# Altium project VENTUNOQ.PrjPcb (part 17 of 18)
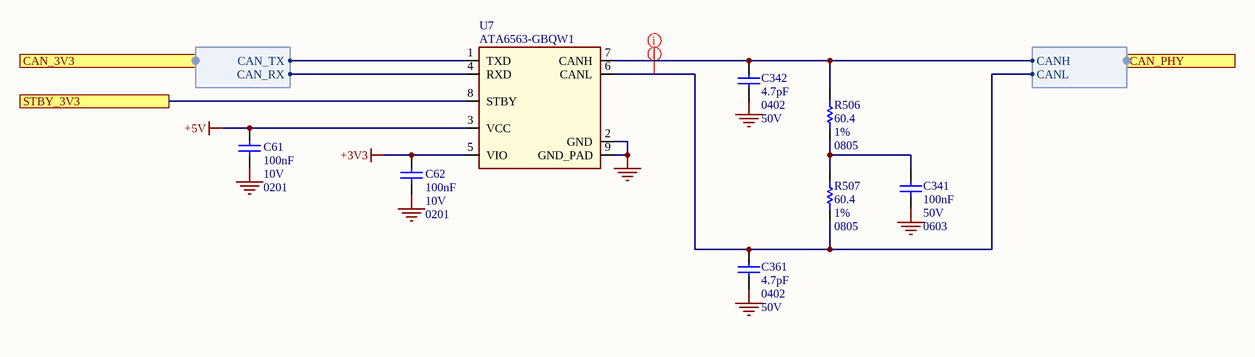
[diagram p52: CAN_PHY.SchDoc]
## Nets that join several sheets
7V-24V: USB_PD_CONTROLLER (D9.A), HEADERS_UNO (F2.1), POWER (11 pins), HEADERS_JOMEGA (8 pins), HEADERS_JMEDIA_JMISC (F3.1)
+1.28V: POWER_REGULATORS_CARRIER (5 pins), AUDIO_CODEC (C136.2 C146.2 U23.36)
+1V1: ETH_PHY (12 pins), POWER_REGULATORS_CARRIER (8 pins), PCIE_PACKET_SWITCH (11 pins), PCIE_USB (39 pins)
+1V8: U_ETH/U_ETH_PHY/U_LOAD_SWITCH_5V (U27_3.6 U27_3.11), POWER (R21.2 R22.2 R265.1 TP84.X), AUDIO_CODEC (7 pins), HDMI_CONVERTER (5 pins), STM32 (R218.1)
+3V3: TOP (11 pins), MODULE_PWR (27 pins), MODULE_CONTROL (12 pins), USB_MUX (R475.2), USB_PD_CONTROLLER (R275.1), U_USB/U_LOAD_SWITCH_5V (C179_1.2 U27_1.3), U_USB/U_LOAD_SWITCH_5V (C179_2.2 U27_2.3), U_ETH/U_ETH_PHY/U_LOAD_SWITCH_5V (C179_3.2 U27_3.3), ETH_RJ45 (J2.14 J2.16), POWER (9 pins), POWER_DCDC_SOM (23 pins), POWER_REGULATORS_CARRIER (9 pins), U_POWER/U_LOAD_SWITCH_5V (C179_4.2 U27_4.3), U_POWER/U_LOAD_SWITCH_5V (C179_5.2 U27_5.3 U27_5.6 U27_5.11), HDMI_CONVERTER (L16.1), U_MIPI/U_MIPI_MUX (C69_1.2 U10_1.1), U_MIPI/U_MIPI_MUX (C69_2.2 U10_2.1), U_MIPI/U_MIPI_FLAT_22PIN (D15_1.2 J3_1.22), U_MIPI/U_MIPI_FLAT_22PIN (D15_2.2 J3_2.22), U_MIPI/U_MIPI_MUX (C69_3.2 U10_3.1), U_MIPI/U_MIPI_FLAT_22PIN (D15_3.2 J3_3.22), U_MIPI/U_TRANSLATOR_4CH (C175_2.2 U21_2.11), HEADERS_JOMEGA (JOMEGA.91 JOMEGA.93 JOMEGA.95), STM32 (35 pins), U_MICROCONTROLLER/U_LED/U_LED_RGB (DL1_1.1), U_MICROCONTROLLER/U_LED/U_LED_RGB (DL1_2.1), U_MICROCONTROLLER/U_LED/U_LED_RGB (DL1_3.1), U_MICROCONTROLLER/U_LED/U_LED_RGB (DL1_4.1), ANALOG_SWITCH (C274.2 U28.4 U28.5), U_MICROCONTROLLER/U_TRANSLATOR_4CH (C175_3.2 U21_3.11), HEADERS_JMEDIA_JMISC (5 pins), HEADERS_JCTL (R317.2), T8CH_ (C174_5.2 U33_5.19), HEATSINK_FAN (C306.2 R261.2 R455.2 U32.5), PCIE (R327.1 R328.1 R329.1), PCIE_PACKET_SWITCH (37 pins), U_PCIE/U_PCIE_NVME/U_LOAD_SWITCH_5V (C179_6.2 U27_6.3 U27_6.6 U27_6.11), WIFI_BLE (12 pins), U_PCIE/U_WIFI_BLE/U_TRANSLATOR_4CH (C175_4.2 U21_4.11), PCIE_USB (13 pins), U_PCIE/U_TRANSLATOR_4CH (C175_5.2 U21_5.11), CAN_PHY (C62.2 U7.5)
+3V3_LIMITED: HEADERS_UNO (JANALOG.2 JANALOG.4), POWER (C222.2), U_POWER/U_LOAD_SWITCH_5V (U27_5.7 U27_5.8 U27_5.9 U27_5.10), HEADERS_JHAT (6 pins), U_HEADERS_JHAT/T8CH_ (C174_2.2 U33_2.19), U_HEADERS_JHAT/T8CH_ (C174_3.2 U33_3.19), U_HEADERS_JHAT/T8CH_ (C174_4.2 U33_4.19), U_HEADERS_JHAT/U_TRANSLATOR_4CH (C175_1.2 U21_1.11), QWIIC (C271.2 D82.2 J13.2)
+5V: USB_PD_CONTROLLER (R276.2), U_USB/U_LOAD_SWITCH_5V (U27_1.6 U27_1.11), U_USB/U_LOAD_SWITCH_5V (U27_2.6 U27_2.11), POWER (R336.1), POWER_REGULATORS_CARRIER (12 pins), U_POWER/U_LOAD_SWITCH_5V (U27_4.6 U27_4.11), AUDIO_CODEC (C165.2 C166.2 U23.14 U23.15), HDMI_CONNECTOR (D3.A R492.2 R495.2), HEADERS_JOMEGA (JOMEGA.97 JOMEGA.99), HEADERS_JMEDIA_JMISC (JMISC.54 JMISC.56), HEATSINK_FAN (5 pins), CAN_PHY (C61.2 U7.3)
+5V_LIMITED: HEADERS_UNO (JANALOG.5 JSPI.2), POWER (C221.2), U_POWER/U_LOAD_SWITCH_5V (U27_4.7 U27_4.8 U27_4.9 U27_4.10), HEADERS_JHAT (J6.2 J6.4)
CYPD_VDDIO: USB_MUX (R476.2), USB_PD_CONTROLLER (13 pins), U_USB/U_USB_PD_CONTROLLER/T8CH_ (C174_1.2 U33_1.19)
GND: TOP (12 pins), MODULE_GND (1526 pins), MODULE_PWR (12 pins), MODULE_SAIL (TP30.X), MODULE_SAIL_FLASH (7 pins), MODULE_STRAPS_MD (10 pins), MODULE_STRAPS_SAIL (13 pins), MODULE_CONTROL (12 pins), USB (12 pins), USB_USBC (19 pins), USB_MUX (13 pins), USB_PD_CONTROLLER (43 pins), U_USB/U_USB_PD_CONTROLLER/T8CH_ (5 pins), USB_USBA (16 pins), U_USB/U_LOAD_SWITCH_5V (C179_1.1 C246_1.1 U27_1.2), U_USB/U_LOAD_SWITCH_5V (C179_2.1 C246_2.1 U27_2.2), ETH (C67.1 C68.1 U8.3 U9.3), ETH_PHY (45 pins), U_ETH/U_ETH_PHY/U_LOAD_SWITCH_5V (C179_3.1 C246_3.1 U27_3.2), ETH_RJ45 (C66.2 R109.1), HEADERS_UNO (5 pins), POWER (30 pins), POWER_DCDC_SOM (51 pins), POWER_REGULATORS_CARRIER (49 pins), U_POWER/U_LOAD_SWITCH_5V (C179_4.1 C246_4.1 U27_4.2), U_POWER/U_LOAD_SWITCH_5V (C179_5.1 C246_5.1 U27_5.2), AUDIO_CODEC (24 pins), HEADERS_JHAT (8 pins), U_HEADERS_JHAT/T8CH_ (5 pins), U_HEADERS_JHAT/T8CH_ (5 pins), U_HEADERS_JHAT/T8CH_ (5 pins), U_HEADERS_JHAT/U_TRANSLATOR_4CH (C172_1.1 C175_1.1 C220_1.2 U21_1.6), VIDEO (5 pins), HDMI (R269.1), HDMI_CONNECTOR (18 pins), HDMI_CONVERTER (22 pins), U_MIPI/U_MIPI_MUX (8 pins), U_MIPI/U_MIPI_MUX (8 pins), U_MIPI/U_MIPI_FLAT_22PIN (17 pins), U_MIPI/U_MIPI_FLAT_22PIN (17 pins), U_MIPI/U_MIPI_MUX (8 pins), U_MIPI/U_MIPI_FLAT_22PIN (17 pins), U_MIPI/U_TRANSLATOR_4CH (C172_2.1 C175_2.1 C220_2.2 U21_2.6), PUSHBUTTONS (6 pins), HEADERS_JOMEGA (50 pins), MICROCONTROLLER (R184.1), STM32 (59 pins), QWIIC (6 pins), ANALOG_SWITCH (C274.1 U28.2), U_MICROCONTROLLER/U_TRANSLATOR_4CH (C172_3.1 C175_3.1 C220_3.2 U21_3.6), HEADERS_JMEDIA_JMISC (63 pins), HEADERS_JCTL (12 pins), T8CH_ (5 pins), HEATSINK_FAN (13 pins), PCIE (R315.1 R323.1 R468.1), PCIE_PACKET_SWITCH (42 pins), PCIE_NVME (40 pins), U_PCIE/U_PCIE_NVME/U_LOAD_SWITCH_5V (C179_6.1 C246_6.1 U27_6.2), WIFI_BLE (63 pins), U_PCIE/U_WIFI_BLE/U_TRANSLATOR_4CH (C172_4.1 C175_4.1 C220_4.2 U21_4.6), PCIE_USB (43 pins), U_PCIE/U_TRANSLATOR_4CH (C172_5.1 C175_5.1 C220_5.2 U21_5.6), CAN_PHY (7 pins)
SOM_VCOIN: MODULE_PWR (R399.1), HEADERS_JMEDIA_JMISC (R508.2)
SOM_VREG_MDPX3_1P8: TOP (10 pins), MODULE_PWR (MODULE1.BD42 MODULE1.BE42 MODULE1.BF42 TP88.X), MODULE_STRAPS_MD (10 pins), USB_PD_CONTROLLER (R330.1 R331.1 R332.1), U_USB/U_USB_PD_CONTROLLER/T8CH_ (C173_1.2 R168_1.2 U33_1.2), POWER (R21.1 R497.2), POWER_REGULATORS_CARRIER (R146.1 R147.1 U16.5 U17.5), AUDIO_CODEC (R270.2), HEADERS_JHAT (R422.1 R423.1 R424.1 R425.1), U_HEADERS_JHAT/T8CH_ (C173_2.2 R168_2.2 U33_2.2), U_HEADERS_JHAT/T8CH_ (C173_3.2 R168_3.2 U33_3.2), U_HEADERS_JHAT/T8CH_ (C173_4.2 R168_4.2 U33_4.2), U_HEADERS_JHAT/U_TRANSLATOR_4CH (C172_1.2 R326_1.2 U21_1.1), VIDEO (8 pins), U_MIPI/U_TRANSLATOR_4CH (C172_2.2 R326_2.2 U21_2.1), HEADERS_JOMEGA (JOMEGA.79 JOMEGA.81), MICROCONTROLLER (R412.1), STM32 (R351.1), U_MICROCONTROLLER/U_TRANSLATOR_4CH (C172_3.2 R326_3.2 U21_3.1), HEADERS_JMEDIA_JMISC (JMISC.57), HEADERS_JCTL (D63.2 JCTL.9 R166.1), T8CH_ (C173_5.2 R168_5.2 U33_5.2), PCIE (R319.1 R320.1 R321.1 R322.2), PCIE_NVME (R224.1 R414.2 R415.2 R416.2), WIFI_BLE (R23.2 R314.1 R465.2), U_PCIE/U_WIFI_BLE/U_TRANSLATOR_4CH (C172_4.2 R326_4.2 U21_4.1), U_PCIE/U_TRANSLATOR_4CH (C172_5.2 R326_5.2 U21_5.1)
SOM_VREG_S5S_SPX3_1P8: MODULE_PWR (MODULE1.AW45 MODULE1.AW46), MODULE_SAIL (TP1.X), MODULE_SAIL_FLASH (12 pins), MODULE_STRAPS_SAIL (13 pins), HEADERS_JOMEGA (JOMEGA.77), HEADERS_JCTL (R458.1)
VBAT: STM32 (C63.2 C282.2 U3.D3), HEADERS_JMEDIA_JMISC (R509.2)
1V05_PG (PULLUP 1V8): ETH_PHY (R85.1), POWER (R265.2), POWER_REGULATORS_CARRIER (U17.1)
3V3_PG (PULLUP 3V3): TOP (R349.1), POWER_DCDC_SOM (R124.2 U11.1 U11.2)
A_CLK_N: U_MIPI/U_MIPI_MUX (U10_1.18), HEADERS_JMEDIA_JMISC (D91.1 D91.10 JMEDIA.3)
A_CLK_N: U_MIPI/U_MIPI_MUX (U10_2.18), HEADERS_JMEDIA_JMISC (D93.4 D93.7 JMEDIA.33)
A_CLK_N: U_MIPI/U_MIPI_MUX (U10_3.18), HEADERS_JMEDIA_JMISC (D96.2 D96.9 JMEDIA.42)
A_CLK_P: U_MIPI/U_MIPI_MUX (U10_1.19), HEADERS_JMEDIA_JMISC (D91.2 D91.9 JMEDIA.5)
A_CLK_P: U_MIPI/U_MIPI_MUX (U10_2.19), HEADERS_JMEDIA_JMISC (D93.5 D93.6 JMEDIA.35)
A_CLK_P: U_MIPI/U_MIPI_MUX (U10_3.19), HEADERS_JMEDIA_JMISC (D96.1 D96.10 JMEDIA.40)
A_LN0_N: U_MIPI/U_MIPI_MUX (U10_1.37), HEADERS_JMEDIA_JMISC (D90.1 D90.10 JMEDIA.12)
A_LN0_N: U_MIPI/U_MIPI_MUX (U10_2.37), HEADERS_JMEDIA_JMISC (D92.4 D92.7 JMEDIA.21)
A_LN0_N: U_MIPI/U_MIPI_MUX (U10_3.37), HEADERS_JMEDIA_JMISC (D97.2 D97.9 JMEDIA.54)
A_LN0_P: U_MIPI/U_MIPI_MUX (U10_1.38), HEADERS_JMEDIA_JMISC (D90.2 D90.9 JMEDIA.10)
A_LN0_P: U_MIPI/U_MIPI_MUX (U10_2.38), HEADERS_JMEDIA_JMISC (D92.5 D92.6 JMEDIA.23)
A_LN0_P: U_MIPI/U_MIPI_MUX (U10_3.38), HEADERS_JMEDIA_JMISC (D97.1 D97.10 JMEDIA.52)
A_LN1_N: U_MIPI/U_MIPI_MUX (U10_1.35), HEADERS_JMEDIA_JMISC (D90.4 D90.7 JMEDIA.6)
A_LN1_N: U_MIPI/U_MIPI_MUX (U10_2.35), HEADERS_JMEDIA_JMISC (D93.1 D93.10 JMEDIA.27)
A_LN1_N: U_MIPI/U_MIPI_MUX (U10_3.35), HEADERS_JMEDIA_JMISC (D96.5 D96.6 JMEDIA.48)
A_LN1_P: U_MIPI/U_MIPI_MUX (U10_1.36), HEADERS_JMEDIA_JMISC (D90.5 D90.6 JMEDIA.4)
A_LN1_P: U_MIPI/U_MIPI_MUX (U10_2.36), HEADERS_JMEDIA_JMISC (D93.2 D93.9 JMEDIA.29)
A_LN1_P: U_MIPI/U_MIPI_MUX (U10_3.36), HEADERS_JMEDIA_JMISC (D96.4 D96.7 JMEDIA.46)
A_LN2_N: U_MIPI/U_MIPI_MUX (U10_1.33), HEADERS_JMEDIA_JMISC (D91.4 D91.7 JMEDIA.9)
A_LN2_N: U_MIPI/U_MIPI_MUX (U10_2.33), HEADERS_JMEDIA_JMISC (D94.1 D94.10 JMEDIA.39)
A_LN2_N: U_MIPI/U_MIPI_MUX (U10_3.33), HEADERS_JMEDIA_JMISC (D95.5 D95.6 JMEDIA.36)
A_LN2_P: U_MIPI/U_MIPI_MUX (U10_1.34), HEADERS_JMEDIA_JMISC (D91.5 D91.6 JMEDIA.11)
A_LN2_P: U_MIPI/U_MIPI_MUX (U10_2.34), HEADERS_JMEDIA_JMISC (D94.2 D94.9 JMEDIA.41)
A_LN2_P: U_MIPI/U_MIPI_MUX (U10_3.34), HEADERS_JMEDIA_JMISC (D95.4 D95.7 JMEDIA.34)
A_LN3_N: U_MIPI/U_MIPI_MUX (U10_1.31), HEADERS_JMEDIA_JMISC (D92.1 D92.10 JMEDIA.15)
A_LN3_N: U_MIPI/U_MIPI_MUX (U10_2.31), HEADERS_JMEDIA_JMISC (D94.4 D94.7 JMEDIA.45)
A_LN3_N: U_MIPI/U_MIPI_MUX (U10_3.31), HEADERS_JMEDIA_JMISC (D95.2 D95.9 JMEDIA.30)
A_LN3_P: U_MIPI/U_MIPI_MUX (U10_1.32), HEADERS_JMEDIA_JMISC (D92.2 D92.9 JMEDIA.17)
A_LN3_P: U_MIPI/U_MIPI_MUX (U10_2.32), HEADERS_JMEDIA_JMISC (D94.5 D94.6 JMEDIA.47)
A_LN3_P: U_MIPI/U_MIPI_MUX (U10_3.32), HEADERS_JMEDIA_JMISC (D95.1 D95.10 JMEDIA.28)
B_CLK_N: HDMI_CONVERTER (U22.F2), U_MIPI/U_MIPI_MUX (U10_1.20)
B_CLK_N: U_MIPI/U_MIPI_MUX (U10_2.20), U_MIPI/U_MIPI_FLAT_22PIN (D7_2.1 D7_2.10 J3_2.8)
B_CLK_N: U_MIPI/U_MIPI_FLAT_22PIN (D7_1.1 D7_1.10 J3_1.8), U_MIPI/U_MIPI_MUX (U10_3.20)
B_CLK_P: HDMI_CONVERTER (U22.G2), U_MIPI/U_MIPI_MUX (U10_1.21)
B_CLK_P: U_MIPI/U_MIPI_MUX (U10_2.21), U_MIPI/U_MIPI_FLAT_22PIN (D7_2.2 D7_2.9 J3_2.9)
B_CLK_P: U_MIPI/U_MIPI_FLAT_22PIN (D7_1.2 D7_1.9 J3_1.9), U_MIPI/U_MIPI_MUX (U10_3.21)
B_LN0_N: HDMI_CONVERTER (U22.F3), U_MIPI/U_MIPI_MUX (U10_1.28)
B_LN0_N: U_MIPI/U_MIPI_MUX (U10_2.28), U_MIPI/U_MIPI_FLAT_22PIN (D6_2.1 D6_2.10 J3_2.2)
B_LN0_N: U_MIPI/U_MIPI_FLAT_22PIN (D6_1.1 D6_1.10 J3_1.2), U_MIPI/U_MIPI_MUX (U10_3.28)
B_LN0_P: HDMI_CONVERTER (U22.G3), U_MIPI/U_MIPI_MUX (U10_1.29)
B_LN0_P: U_MIPI/U_MIPI_MUX (U10_2.29), U_MIPI/U_MIPI_FLAT_22PIN (D6_2.2 D6_2.9 J3_2.3)
B_LN0_P: U_MIPI/U_MIPI_FLAT_22PIN (D6_1.2 D6_1.9 J3_1.3), U_MIPI/U_MIPI_MUX (U10_3.29)
B_LN1_N: HDMI_CONVERTER (U22.F4), U_MIPI/U_MIPI_MUX (U10_1.26)
B_LN1_N: U_MIPI/U_MIPI_MUX (U10_2.26), U_MIPI/U_MIPI_FLAT_22PIN (D6_2.4 D6_2.7 J3_2.5)
B_LN1_N: U_MIPI/U_MIPI_FLAT_22PIN (D6_1.4 D6_1.7 J3_1.5), U_MIPI/U_MIPI_MUX (U10_3.26)
B_LN1_P: HDMI_CONVERTER (U22.G4), U_MIPI/U_MIPI_MUX (U10_1.27)
B_LN1_P: U_MIPI/U_MIPI_MUX (U10_2.27), U_MIPI/U_MIPI_FLAT_22PIN (D6_2.5 D6_2.6 J3_2.6)
B_LN1_P: U_MIPI/U_MIPI_FLAT_22PIN (D6_1.5 D6_1.6 J3_1.6), U_MIPI/U_MIPI_MUX (U10_3.27)
B_LN2_N: HDMI_CONVERTER (U22.F5), U_MIPI/U_MIPI_MUX (U10_1.24)
B_LN2_N: U_MIPI/U_MIPI_MUX (U10_2.24), U_MIPI/U_MIPI_FLAT_22PIN (D7_2.4 D7_2.7 J3_2.11)
B_LN2_N: U_MIPI/U_MIPI_FLAT_22PIN (D7_1.4 D7_1.7 J3_1.11), U_MIPI/U_MIPI_MUX (U10_3.24)
B_LN2_P: HDMI_CONVERTER (U22.G5), U_MIPI/U_MIPI_MUX (U10_1.25)
B_LN2_P: U_MIPI/U_MIPI_MUX (U10_2.25), U_MIPI/U_MIPI_FLAT_22PIN (D7_2.5 D7_2.6 J3_2.12)
B_LN2_P: U_MIPI/U_MIPI_FLAT_22PIN (D7_1.5 D7_1.6 J3_1.12), U_MIPI/U_MIPI_MUX (U10_3.25)
B_LN3_N: HDMI_CONVERTER (U22.F6), U_MIPI/U_MIPI_MUX (U10_1.22)
B_LN3_N: U_MIPI/U_MIPI_MUX (U10_2.22), U_MIPI/U_MIPI_FLAT_22PIN (D8_2.1 D8_2.10 J3_2.14)
B_LN3_N: U_MIPI/U_MIPI_FLAT_22PIN (D8_1.1 D8_1.10 J3_1.14), U_MIPI/U_MIPI_MUX (U10_3.22)
B_LN3_P: HDMI_CONVERTER (U22.G6), U_MIPI/U_MIPI_MUX (U10_1.23)
B_LN3_P: U_MIPI/U_MIPI_MUX (U10_2.23), U_MIPI/U_MIPI_FLAT_22PIN (D8_2.2 D8_2.9 J3_2.15)
B_LN3_P: U_MIPI/U_MIPI_FLAT_22PIN (D8_1.2 D8_1.9 J3_1.15), U_MIPI/U_MIPI_MUX (U10_3.23)
BOOT0: HEADERS_UNO (JANALOG.1), MICROCONTROLLER (R151.1), STM32 (R352.2 R385.1 TP90.X)
CLKREQ_N_1V8: MODULE_MD (MODULE1.AW17), PCIE (R320.2), U_PCIE/U_TRANSLATOR_4CH (U21_5.3)
CLKREQ_N_3V3: PCIE (R328.2), PCIE_PACKET_SWITCH (U34.AM34), U_PCIE/U_TRANSLATOR_4CH (U21_5.9)
CSI0_CK_N: MODULE_MD (MODULE1.AK45), U_MIPI/U_MIPI_MUX (U10_2.15)
CSI0_CK_P: MODULE_MD (MODULE1.AK46), U_MIPI/U_MIPI_MUX (U10_2.14)
CSI0_L0_N: MODULE_MD (MODULE1.AL44), U_MIPI/U_MIPI_MUX (U10_2.6)
CSI0_L0_P: MODULE_MD (MODULE1.AL45), U_MIPI/U_MIPI_MUX (U10_2.5)
CSI0_L1_N: MODULE_MD (MODULE1.AM45), U_MIPI/U_MIPI_MUX (U10_2.8)
CSI0_L1_P: MODULE_MD (MODULE1.AM46), U_MIPI/U_MIPI_MUX (U10_2.7)
CSI0_L2_N: MODULE_MD (MODULE1.AN44), U_MIPI/U_MIPI_MUX (U10_2.11)
CSI0_L2_P: MODULE_MD (MODULE1.AN45), U_MIPI/U_MIPI_MUX (U10_2.10)
CSI0_L3_N: MODULE_MD (MODULE1.AP45), U_MIPI/U_MIPI_MUX (U10_2.13)
CSI0_L3_P: MODULE_MD (MODULE1.AP46), U_MIPI/U_MIPI_MUX (U10_2.12)
CSI1_CK_N: MODULE_MD (MODULE1.AE44), U_MIPI/U_MIPI_MUX (U10_3.15)
CSI1_CK_P: MODULE_MD (MODULE1.AE45), U_MIPI/U_MIPI_MUX (U10_3.14)
CSI1_L0_N: MODULE_MD (MODULE1.AF45), U_MIPI/U_MIPI_MUX (U10_3.6)
CSI1_L0_P: MODULE_MD (MODULE1.AF46), U_MIPI/U_MIPI_MUX (U10_3.5)
CSI1_L1_N: MODULE_MD (MODULE1.AG44), U_MIPI/U_MIPI_MUX (U10_3.8)
CSI1_L1_P: MODULE_MD (MODULE1.AG45), U_MIPI/U_MIPI_MUX (U10_3.7)
CSI1_L2_N: MODULE_MD (MODULE1.AH45), U_MIPI/U_MIPI_MUX (U10_3.11)
CSI1_L2_P: MODULE_MD (MODULE1.AH46), U_MIPI/U_MIPI_MUX (U10_3.10)
CSI1_L3_N: MODULE_MD (MODULE1.AJ44), U_MIPI/U_MIPI_MUX (U10_3.13)
CSI1_L3_P: MODULE_MD (MODULE1.AJ45), U_MIPI/U_MIPI_MUX (U10_3.12)
CSI2_CK_N: MODULE_MD (MODULE1.Y45), U_MIPI/U_MIPI_FLAT_22PIN (D7_3.1 D7_3.10 J3_3.8)
CSI2_CK_P: MODULE_MD (MODULE1.Y46), U_MIPI/U_MIPI_FLAT_22PIN (D7_3.2 D7_3.9 J3_3.9)
CSI2_L0_N: MODULE_MD (MODULE1.AA44), U_MIPI/U_MIPI_FLAT_22PIN (D6_3.1 D6_3.10 J3_3.2)
CSI2_L0_P: MODULE_MD (MODULE1.AA45), U_MIPI/U_MIPI_FLAT_22PIN (D6_3.2 D6_3.9 J3_3.3)
CSI2_L1_N: MODULE_MD (MODULE1.AB45), U_MIPI/U_MIPI_FLAT_22PIN (D6_3.4 D6_3.7 J3_3.5)
CSI2_L1_P: MODULE_MD (MODULE1.AB46), U_MIPI/U_MIPI_FLAT_22PIN (D6_3.5 D6_3.6 J3_3.6)
CSI2_L2_N: MODULE_MD (MODULE1.AC44), U_MIPI/U_MIPI_FLAT_22PIN (D7_3.4 D7_3.7 J3_3.11)
CSI2_L2_P: MODULE_MD (MODULE1.AC45), U_MIPI/U_MIPI_FLAT_22PIN (D7_3.5 D7_3.6 J3_3.12)
CSI2_L3_N: MODULE_MD (MODULE1.AD45), U_MIPI/U_MIPI_FLAT_22PIN (D8_3.1 D8_3.10 J3_3.14)
CSI2_L3_P: MODULE_MD (MODULE1.AD46), U_MIPI/U_MIPI_FLAT_22PIN (D8_3.2 D8_3.9 J3_3.15)
CTS_1V8: MODULE_MD (MODULE1.AA41), U_HEADERS_JHAT/U_TRANSLATOR_4CH (U21_1.5), WIFI_BLE (R380.1)
DSI0_CK_N: MODULE_MD (MODULE1.T46), U_MIPI/U_MIPI_MUX (U10_1.15)
DSI0_CK_P: MODULE_MD (MODULE1.T45), U_MIPI/U_MIPI_MUX (U10_1.14)
DSI0_L0_N: MODULE_MD (MODULE1.P46), U_MIPI/U_MIPI_MUX (U10_1.6)
DSI0_L0_P: MODULE_MD (MODULE1.P45), U_MIPI/U_MIPI_MUX (U10_1.5)
DSI0_L1_N: MODULE_MD (MODULE1.R45), U_MIPI/U_MIPI_MUX (U10_1.8)
DSI0_L1_P: MODULE_MD (MODULE1.R44), U_MIPI/U_MIPI_MUX (U10_1.7)
DSI0_L2_N: MODULE_MD (MODULE1.U45), U_MIPI/U_MIPI_MUX (U10_1.11)
DSI0_L2_P: MODULE_MD (MODULE1.U44), U_MIPI/U_MIPI_MUX (U10_1.10)
DSI0_L3_N: MODULE_MD (MODULE1.V46), U_MIPI/U_MIPI_MUX (U10_1.13)
DSI0_L3_P: MODULE_MD (MODULE1.V45), U_MIPI/U_MIPI_MUX (U10_1.12)
DVDD18: ETH (C67.2 C68.2 U8.5 U9.5), ETH_PHY (19 pins), U_ETH/U_ETH_PHY/U_LOAD_SWITCH_5V (U27_3.7 U27_3.8 U27_3.9 U27_3.10)
EDP0_AUX_N: MODULE_MD (MODULE1.B29), USB_PD_CONTROLLER (U5.35)
EDP0_AUX_P: MODULE_MD (MODULE1.A29), USB_PD_CONTROLLER (U5.36)
EDP0_TX0_N: MODULE_MD (MODULE1.B21), USB_MUX (U6.40)
EDP0_TX0_P: MODULE_MD (MODULE1.A21), USB_MUX (U6.39)
EDP0_TX1_N: MODULE_MD (MODULE1.B23), USB_MUX (U6.3)
EDP0_TX1_P: MODULE_MD (MODULE1.A23), USB_MUX (U6.2)
EDP0_TX2_N: MODULE_MD (MODULE1.B25), USB_MUX (U6.6)
EDP0_TX2_P: MODULE_MD (MODULE1.A25), USB_MUX (U6.5)
EDP0_TX3_N: MODULE_MD (MODULE1.B27), USB_MUX (U6.9)
EDP0_TX3_P: MODULE_MD (MODULE1.A27), USB_MUX (U6.8)
ETH_PHY_TRX0_N: ETH_PHY (R70.2 U1.54), ETH_RJ45 (J2.10)
ETH_PHY_TRX0_P: ETH_PHY (R69.2 U1.53), ETH_RJ45 (J2.11)
ETH_PHY_TRX1_N: ETH_PHY (R72.2 U1.5), ETH_RJ45 (J2.5)
ETH_PHY_TRX1_P: ETH_PHY (R71.2 U1.4), ETH_RJ45 (J2.4)
ETH_PHY_TRX2_N: ETH_PHY (R74.2 U1.10), ETH_RJ45 (J2.2)
ETH_PHY_TRX2_P: ETH_PHY (R73.2 U1.9), ETH_RJ45 (J2.3)
ETH_PHY_TRX3_N: ETH_PHY (R76.2 U1.17), ETH_RJ45 (J2.9)
ETH_PHY_TRX3_P: ETH_PHY (R75.2 U1.16), ETH_RJ45 (J2.8)
FLAT0_GPIO_PIN17_3V3: VIDEO (R389.1), U_MIPI/U_MIPI_FLAT_22PIN (D8_2.4 D8_2.7 J3_2.17), U_MIPI/U_TRANSLATOR_4CH (U21_2.10)
FLAT1_GPIO_PIN17_3V3: VIDEO (R390.1), U_MIPI/U_MIPI_FLAT_22PIN (D8_1.4 D8_1.7 J3_1.17), U_MIPI/U_TRANSLATOR_4CH (U21_2.9)
FLAT2_GPIO_PIN17_3V3: VIDEO (R391.1), U_MIPI/U_MIPI_FLAT_22PIN (D8_3.4 D8_3.7 J3_3.17), U_MIPI/U_TRANSLATOR_4CH (U21_2.8)
FORCE_BOOT_3V3: TOP (R484.1), HEADERS_JOMEGA (JOMEGA.89), HEADERS_JCTL (6 pins)
GPIO4_SWDIO: USB_PD_CONTROLLER (TP39.X U5.27), U_USB/U_USB_PD_CONTROLLER/T8CH_ (U33_1.16)
GPIO5_SWCLK: USB_PD_CONTROLLER (TP38.X U5.28), U_USB/U_USB_PD_CONTROLLER/T8CH_ (U33_1.15)
GPIO_0: MODULE_MD (MODULE1.AY17), PCIE (R319.2), U_PCIE/U_TRANSLATOR_4CH (U21_5.2)
GPIO_2: MODULE_MD (MODULE1.AY16), PCIE (R321.2), U_PCIE/U_TRANSLATOR_4CH (U21_5.4)
GPIO_4: MODULE_MD (MODULE1.AW25), ETH_PHY (R284.1 R285.1 R413.1)
GPIO_5: MODULE_MD (MODULE1.AY24), ETH_PHY (R266.1 U1.33)
GPIO_6: MODULE_MD (MODULE1.AW24), ETH_PHY (R267.1 U1.34)
GPIO_7: MODULE_MD (MODULE1.BA11), MODULE_STRAPS_MD (R13.2 R28.2)
GPIO_8: MODULE_MD (MODULE1.AY11), MODULE_STRAPS_MD (R15.2 R30.2)
GPIO_21: MODULE_MD (MODULE1.AW19), PCIE_NVME (R414.1 R417.2)
GPIO_22: MODULE_MD (MODULE1.AY20), PCIE_NVME (R415.1 R418.2)
GPIO_23: MODULE_MD (MODULE1.AW20), PCIE_NVME (R416.1 R419.2)
GPIO_50: MODULE_MD (MODULE1.AB43), ETH_PHY (U1.35)
GPIO_53: MODULE_MD (MODULE1.AW11), MODULE_STRAPS_MD (R12.2 R27.2)
GPIO_66: MODULE_MD (MODULE1.Y42), MODULE_STRAPS_MD (R14.2 R29.2)
GPIO_76: MODULE_MD (MODULE1.V38), MODULE_STRAPS_MD (R2.2 R17.2)
GPIO_91: MODULE_MD (MODULE1.AE42), MODULE_STRAPS_MD (R1.2 R16.2)
GPIO_97: MODULE_MD (MODULE1.E26), MODULE_STRAPS_MD (R3.2 R18.2)
GPIO_98: MODULE_MD (MODULE1.E23), MODULE_STRAPS_MD (R4.2 R19.2)
GPIO_102: MODULE_MD (MODULE1.D26), MODULE_STRAPS_MD (R5.2 R20.2)
HDMI_CLK_N: HDMI_CONNECTOR (D14.5 D14.6 J4.12), HDMI_CONVERTER (U22.B7)
HDMI_CLK_P: HDMI_CONNECTOR (D14.4 D14.7 J4.10), HDMI_CONVERTER (U22.A7)
HDMI_TX0_N: HDMI_CONNECTOR (D13.5 D13.6 J4.9), HDMI_CONVERTER (U22.A6)
HDMI_TX0_P: HDMI_CONNECTOR (D13.4 D13.7 J4.7), HDMI_CONVERTER (U22.A5)
HDMI_TX1_N: HDMI_CONNECTOR (D14.2 D14.9 J4.6), HDMI_CONVERTER (U22.A4)
HDMI_TX1_P: HDMI_CONNECTOR (D14.1 D14.10 J4.4), HDMI_CONVERTER (U22.A3)
HDMI_TX2_N: HDMI_CONNECTOR (D13.2 D13.9 J4.3), HDMI_CONVERTER (U22.A2)
HDMI_TX2_P: HDMI_CONNECTOR (D13.1 D13.10 J4.1), HDMI_CONVERTER (U22.A1)
I2C1_IRQ: USB_PD_CONTROLLER (R99.1 R333.2), U_USB/U_USB_PD_CONTROLLER/T8CH_ (U33_1.20)
I2C1_SCL: USB_PD_CONTROLLER (R100.1 R334.2), U_USB/U_USB_PD_CONTROLLER/T8CH_ (U33_1.18)
I2C1_SDA: USB_PD_CONTROLLER (R101.1 R335.2), U_USB/U_USB_PD_CONTROLLER/T8CH_ (U33_1.17)
I2S_DATA0: MODULE_MD (MODULE1.A32), U_HEADERS_JHAT/U_TRANSLATOR_4CH (U21_1.3)
I2S_DATA1: MODULE_MD (MODULE1.A34), U_HEADERS_JHAT/U_TRANSLATOR_4CH (U21_1.2)
I2S_SCK: MODULE_MD (MODULE1.A31), U_HEADERS_JHAT/T8CH_ (U33_2.3)
I2S_WS: MODULE_MD (MODULE1.A33), U_HEADERS_JHAT/T8CH_ (U33_4.1)
JHAT_GPIO_0: HEADERS_JHAT (J6.27 R171.2), U_HEADERS_JHAT/T8CH_ (U33_4.13)
JHAT_GPIO_1: HEADERS_JHAT (J6.28 R122.2), U_HEADERS_JHAT/T8CH_ (U33_4.14)
JHAT_GPIO_2: HEADERS_JHAT (J6.3 R170.2), U_HEADERS_JHAT/T8CH_ (U33_2.12)
JHAT_GPIO_3: HEADERS_JHAT (J6.5 R169.2), U_HEADERS_JHAT/T8CH_ (U33_2.13)
JHAT_GPIO_4: HEADERS_JHAT (J6.7), U_HEADERS_JHAT/T8CH_ (U33_2.15)
JHAT_GPIO_5: HEADERS_JHAT (J6.29), U_HEADERS_JHAT/T8CH_ (U33_4.15)
JHAT_GPIO_6: HEADERS_JHAT (J6.31), U_HEADERS_JHAT/T8CH_ (U33_4.16)
JHAT_GPIO_7: HEADERS_JHAT (J6.26), U_HEADERS_JHAT/T8CH_ (U33_4.12)
JHAT_GPIO_8: HEADERS_JHAT (J6.24), U_HEADERS_JHAT/T8CH_ (U33_3.20)
JHAT_GPIO_9: HEADERS_JHAT (J6.21), U_HEADERS_JHAT/T8CH_ (U33_3.16)
JHAT_GPIO_10: HEADERS_JHAT (J6.19), U_HEADERS_JHAT/T8CH_ (U33_3.14)
JHAT_GPIO_11: HEADERS_JHAT (J6.23), U_HEADERS_JHAT/T8CH_ (U33_3.17)
JHAT_GPIO_12: HEADERS_JHAT (J6.32), U_HEADERS_JHAT/T8CH_ (U33_4.17)
JHAT_GPIO_13: HEADERS_JHAT (J6.33), U_HEADERS_JHAT/T8CH_ (U33_4.18)
JHAT_GPIO_14: HEADERS_JHAT (J6.8), U_HEADERS_JHAT/T8CH_ (U33_2.14)
JHAT_GPIO_15: HEADERS_JHAT (J6.10), U_HEADERS_JHAT/T8CH_ (U33_2.16)
JHAT_GPIO_16: HEADERS_JHAT (J6.36), U_HEADERS_JHAT/U_TRANSLATOR_4CH (U21_1.7)
JHAT_GPIO_17: HEADERS_JHAT (J6.11), U_HEADERS_JHAT/T8CH_ (U33_2.17)
JHAT_GPIO_18: HEADERS_JHAT (J6.12), U_HEADERS_JHAT/T8CH_ (U33_2.18)
JHAT_GPIO_19: HEADERS_JHAT (J6.35), U_HEADERS_JHAT/T8CH_ (U33_4.20)
JHAT_GPIO_20: HEADERS_JHAT (J6.38), U_HEADERS_JHAT/U_TRANSLATOR_4CH (U21_1.9)
JHAT_GPIO_21: HEADERS_JHAT (J6.40), U_HEADERS_JHAT/U_TRANSLATOR_4CH (U21_1.10)
JHAT_GPIO_22: HEADERS_JHAT (J6.15), U_HEADERS_JHAT/T8CH_ (U33_3.12)
JHAT_GPIO_23: HEADERS_JHAT (J6.16), U_HEADERS_JHAT/T8CH_ (U33_3.13)
JHAT_GPIO_24: HEADERS_JHAT (J6.18), U_HEADERS_JHAT/T8CH_ (U33_3.15)
JHAT_GPIO_25: HEADERS_JHAT (J6.22), U_HEADERS_JHAT/T8CH_ (U33_3.18)
JHAT_GPIO_26: HEADERS_JHAT (J6.37), U_HEADERS_JHAT/U_TRANSLATOR_4CH (U21_1.8)
JHAT_GPIO_27: HEADERS_JHAT (J6.13), U_HEADERS_JHAT/T8CH_ (U33_2.20)
MD_CCI_I2C0.SCL: TOP (R252.2), MODULE_MD (MODULE1.AJ41), HEADERS_JMEDIA_JMISC (D83.2 JMEDIA.51), T8CH_ (U33_5.4)
MD_CCI_I2C0.SDA: TOP (R253.2), MODULE_MD (MODULE1.AJ40), HEADERS_JMEDIA_JMISC (D84.2 JMEDIA.53), T8CH_ (U33_5.5)
MD_CCI_I2C0_3V3.SCL: TOP (R159.2), U_MIPI/U_MIPI_FLAT_22PIN (D10_2.2 J3_2.20), T8CH_ (U33_5.17)
MD_CCI_I2C0_3V3.SDA: TOP (R160.2), U_MIPI/U_MIPI_FLAT_22PIN (D11_2.2 J3_2.21), T8CH_ (U33_5.16)
MD_CCI_I2C2.SCL: TOP (R254.2), MODULE_MD (MODULE1.AK42), HEADERS_JMEDIA_JMISC (D89.2 JMEDIA.24), T8CH_ (U33_5.6)
MD_CCI_I2C2.SDA: TOP (R255.2), MODULE_MD (MODULE1.AJ39), HEADERS_JMEDIA_JMISC (D88.2 JMEDIA.22), T8CH_ (U33_5.7)
MD_CCI_I2C2_3V3.SCL: TOP (R164.2), U_MIPI/U_MIPI_FLAT_22PIN (D10_1.2 J3_1.20), T8CH_ (U33_5.15)
MD_CCI_I2C2_3V3.SDA: TOP (R175.2), U_MIPI/U_MIPI_FLAT_22PIN (D11_1.2 J3_1.21), T8CH_ (U33_5.14)
MD_CCI_I2C3.SCL: MODULE_MD (MODULE1.AD40), STM32 (U3.C6)
MD_CCI_I2C3.SDA: MODULE_MD (MODULE1.AY25), STM32 (U3.A5)
MD_CCI_I2C4.SCL: TOP (R256.2), MODULE_MD (MODULE1.AG42), T8CH_ (U33_5.8)
MD_CCI_I2C4.SDA: TOP (R257.2), MODULE_MD (MODULE1.AG41), T8CH_ (U33_5.9)
MD_CCI_I2C4_3V3.SCL: TOP (R176.2), U_MIPI/U_MIPI_FLAT_22PIN (D10_3.2 J3_3.20), T8CH_ (U33_5.13)
MD_CCI_I2C4_3V3.SDA: TOP (R177.2), U_MIPI/U_MIPI_FLAT_22PIN (D11_3.2 J3_3.21), T8CH_ (U33_5.12)
MD_GPIO_3: MODULE_MD (MODULE1.D37), USB_PD_CONTROLLER (R186.1 R330.2)
MD_GPIO_10: MODULE_MD (MODULE1.AW30), HEADERS_JMEDIA_JMISC (D101.1 D101.10 JMISC.37)
MD_GPIO_11: MODULE_MD (MODULE1.AV29), HEADERS_JMEDIA_JMISC (D101.2 D101.9 JMISC.39)
MD_GPIO_12: MODULE_MD (MODULE1.AY30), HEADERS_JMEDIA_JMISC (D101.4 D101.7 JMISC.41)
MD_GPIO_13: MODULE_MD (MODULE1.AW29), HEADERS_JMEDIA_JMISC (D101.5 D101.6 JMISC.43)
MD_GPIO_14: MODULE_MD (MODULE1.AY28), HEADERS_JMEDIA_JMISC (D102.2 D102.9 JMISC.47)
MD_GPIO_15: MODULE_MD (MODULE1.AW28), HEADERS_JMEDIA_JMISC (D102.1 D102.10 JMISC.45)
MD_GPIO_16: MODULE_MD (MODULE1.AV28), AUDIO_CODEC (R270.1 U23.43)
MD_GPIO_17: MODULE_MD (MODULE1.E34), HEADERS_JHAT (R423.2), U_HEADERS_JHAT/T8CH_ (U33_2.9)
MD_GPIO_18: MODULE_MD (MODULE1.E33), HEADERS_JHAT (R422.2), U_HEADERS_JHAT/T8CH_ (U33_2.8)
MD_GPIO_19: MODULE_MD (MODULE1.C37), HEADERS_JHAT (R425.2), U_HEADERS_JHAT/T8CH_ (U33_4.8)
MD_GPIO_20: MODULE_MD (MODULE1.B37), HEADERS_JHAT (R424.2), U_HEADERS_JHAT/T8CH_ (U33_4.7)
MD_GPIO_24: MODULE_MD (MODULE1.E37), VIDEO (R165.1), U_MIPI/U_MIPI_MUX (U10_2.17)
MD_GPIO_25: MODULE_MD (MODULE1.Y40), U_HEADERS_JHAT/T8CH_ (U33_3.5)
MD_GPIO_26: MODULE_MD (MODULE1.Y43), U_HEADERS_JHAT/T8CH_ (U33_3.7)
MD_GPIO_27: MODULE_MD (MODULE1.V40), U_HEADERS_JHAT/T8CH_ (U33_3.4)
MD_GPIO_28: MODULE_MD (MODULE1.V39), U_HEADERS_JHAT/T8CH_ (U33_3.1)
MD_GPIO_29: MODULE_MD (MODULE1.AD41), PCIE_NVME (R226.1)
MD_GPIO_30: MODULE_MD (MODULE1.AD42), PCIE_NVME (R225.1)
MD_GPIO_37: MODULE_MD (MODULE1.Y39), HEADERS_JOMEGA (D36.4 D36.7 JOMEGA.66)
MD_GPIO_38: MODULE_MD (MODULE1.W40), HEADERS_JOMEGA (D36.5 D36.6 JOMEGA.68)
MD_GPIO_39: MODULE_MD (MODULE1.W41), HEADERS_JOMEGA (D36.1 D36.10 JOMEGA.62)
MD_GPIO_40: MODULE_MD (MODULE1.W42), HEADERS_JOMEGA (D36.2 D36.9 JOMEGA.64)
MD_GPIO_41: MODULE_MD (MODULE1.AC40), VIDEO (R387.1), U_MIPI/U_MIPI_MUX (U10_3.17)
MD_GPIO_42: MODULE_MD (MODULE1.AC39), MICROCONTROLLER (R408.2)
MD_GPIO_43: MODULE_MD (MODULE1.Y41), HEADERS_JOMEGA (JOMEGA.83), HEADERS_JCTL (D65.2 JCTL.4)
MD_GPIO_44: MODULE_MD (MODULE1.D36), HEADERS_JOMEGA (JOMEGA.85), HEADERS_JCTL (D66.2 JCTL.6)
MD_GPIO_45: TOP (R251.2), MODULE_MD (MODULE1.AC42), USB_PD_CONTROLLER (R237.1 R332.2), AUDIO_CODEC (R277.1), HDMI_CONVERTER (R228.2), T8CH_ (U33_5.3)
MD_GPIO_46: TOP (R250.2), MODULE_MD (MODULE1.AB41), USB_PD_CONTROLLER (R235.1 R331.2), AUDIO_CODEC (R278.1), HDMI_CONVERTER (R227.2), T8CH_ (U33_5.1)
MD_GPIO_47: MODULE_MD (MODULE1.AB39), MICROCONTROLLER (R362.2)
MD_GPIO_48: MODULE_MD (MODULE1.AC41), USB_PD_CONTROLLER (R178.1)
MD_GPIO_49: MODULE_MD (MODULE1.Y38), POWER (R496.2)
MD_GPIO_51: MODULE_MD (MODULE1.AA38), PCIE_NVME (R179.2), U_PCIE/U_PCIE_NVME/U_LOAD_SWITCH_5V (U27_6.1)
MD_GPIO_52: TOP (R174.1), MODULE_MD (MODULE1.AA42), HEADERS_JOMEGA (D25.2 D25.9 JOMEGA.72)
MD_GPIO_54: MODULE_MD (MODULE1.E35), WIFI_BLE (R312.1)
MD_GPIO_55: MODULE_MD (MODULE1.E36), PCIE (R322.1 R468.2), WIFI_BLE (R313.1)
MD_GPIO_56: MODULE_MD (MODULE1.W39), WIFI_BLE (R439.1)
MD_GPIO_63: MODULE_MD (MODULE1.AH42), MICROCONTROLLER (R409.2)
MD_GPIO_64: MODULE_MD (MODULE1.AF39), U_MIPI/U_TRANSLATOR_4CH (U21_2.2)
MD_GPIO_65: MODULE_MD (MODULE1.AH41), WIFI_BLE (R381.1)
MD_GPIO_67: MODULE_MD (MODULE1.W38), HEADERS_JMEDIA_JMISC (D86.2 JMEDIA.16)
MD_GPIO_68: MODULE_MD (MODULE1.W43), HEADERS_JMEDIA_JMISC (D87.2 JMEDIA.18)
MD_GPIO_69: MODULE_MD (MODULE1.V42), MICROCONTROLLER (R365.2)
MD_GPIO_70: MODULE_MD (MODULE1.AG40), MICROCONTROLLER (R363.2)
MD_GPIO_71: MODULE_MD (MODULE1.AG39), MICROCONTROLLER (R364.2)
MD_GPIO_73: MODULE_MD (MODULE1.AH40), HEADERS_JMEDIA_JMISC (D102.4 D102.7 JMISC.49)
MD_GPIO_74: MODULE_MD (MODULE1.AJ42), HEADERS_JMEDIA_JMISC (D102.5 D102.6 JMISC.51)
MD_GPIO_75: MODULE_MD (MODULE1.AH39), U_MIPI/U_TRANSLATOR_4CH (U21_2.3)
MD_GPIO_77: MODULE_MD (MODULE1.D34), U_HEADERS_JHAT/T8CH_ (U33_4.4)
MD_GPIO_78: MODULE_MD (MODULE1.AY12), MICROCONTROLLER (R361.2 R412.2)
MD_GPIO_79: TOP (R258.1), MODULE_MD (MODULE1.AW12), PUSHBUTTONS (C205.2 R401.1), HEADERS_JOMEGA (D25.5 D25.6 JOMEGA.76)
MD_GPIO_80: MODULE_MD (MODULE1.M45), U_HEADERS_JHAT/T8CH_ (U33_4.5)
MD_GPIO_81: MODULE_MD (MODULE1.M46), U_HEADERS_JHAT/T8CH_ (U33_4.3)
MD_GPIO_82: MODULE_MD (MODULE1.L45), U_MIPI/U_TRANSLATOR_4CH (U21_2.4)
MD_GPIO_83: MODULE_MD (MODULE1.L46), U_HEADERS_JHAT/T8CH_ (U33_2.6)
MD_GPIO_85: MODULE_MD (MODULE1.AA40), U_HEADERS_JHAT/T8CH_ (U33_2.4), WIFI_BLE (R379.1)
MD_GPIO_86: MODULE_MD (MODULE1.AA39), U_HEADERS_JHAT/T8CH_ (U33_2.7), WIFI_BLE (R378.1)
MD_GPIO_87: MODULE_MD (MODULE1.AB42), U_HEADERS_JHAT/T8CH_ (U33_2.5), WIFI_BLE (R377.1)
MD_GPIO_88: MODULE_MD (MODULE1.AB40), U_HEADERS_JHAT/T8CH_ (U33_4.9)
MD_GPIO_89: MODULE_MD (MODULE1.AD39), U_HEADERS_JHAT/T8CH_ (U33_4.6)
MD_GPIO_90: MODULE_MD (MODULE1.AE39), U_HEADERS_JHAT/T8CH_ (U33_3.9)
MD_GPIO_92: MODULE_MD (MODULE1.AE41), MICROCONTROLLER (R366.2)
MD_GPIO_93: MODULE_MD (MODULE1.V43), HDMI_CONVERTER (U22.D5)
MD_GPIO_94: MODULE_MD (MODULE1.C28), USB_PD_CONTROLLER (R161.1)
MD_GPIO_95: MODULE_MD (MODULE1.C35), MICROCONTROLLER (R410.2)
MD_GPIO_96: MODULE_MD (MODULE1.C34), MICROCONTROLLER (R411.2)
MD_GPIO_99: MODULE_MD (MODULE1.E25), MODULE_STRAPS_MD (R115.2 R116.2)
MD_GPIO_100: MODULE_MD (MODULE1.E24), WIFI_BLE (R388.1)
MD_GPIO_101: MODULE_MD (MODULE1.D24), WIFI_BLE (R438.1)
MD_GPIO_103: TOP (R433.2 R479.2), MODULE_MD (MODULE1.D23)
MD_GPIO_104: MODULE_MD (MODULE1.D25), USB_PD_CONTROLLER (R187.1)
MD_GPIO_105: MODULE_MD (MODULE1.E28), U_HEADERS_JHAT/T8CH_ (U33_3.8)
MD_GPIO_106: MODULE_MD (MODULE1.D27), U_HEADERS_JHAT/T8CH_ (U33_3.6)
MD_GPIO_107: MODULE_MD (MODULE1.E32), U_HEADERS_JHAT/T8CH_ (U33_3.3)
MD_GPIO_108: MODULE_MD (MODULE1.F27), U_HEADERS_JHAT/U_TRANSLATOR_4CH (U21_1.4)
MD_GPIO_109: MODULE_MD (MODULE1.E27), U_HEADERS_JHAT/T8CH_ (U33_2.1)
MD_LPASS_GPIO_110: MODULE_MD (MODULE1.F28), AUDIO_CODEC (R282.1)
MD_LPASS_GPIO_111: MODULE_MD (MODULE1.D30), AUDIO_CODEC (R281.1)
MD_LPASS_GPIO_112: MODULE_MD (MODULE1.E30), AUDIO_CODEC (R280.1)
MD_LPASS_GPIO_113: MODULE_MD (MODULE1.E31), AUDIO_CODEC (R279.1)
MD_LPASS_GPIO_115: MODULE_MD (MODULE1.D29), AUDIO_CODEC (R283.1)
MD_LPASS_GPIO_120: MODULE_MD (MODULE1.D31), HEADERS_JMEDIA_JMISC (D105.1 D105.10 JMISC.46)
MD_LPASS_GPIO_121: MODULE_MD (MODULE1.C32), HEADERS_JMEDIA_JMISC (D105.2 D105.9 JMISC.48)
MD_LPASS_GPIO_122: MODULE_MD (MODULE1.C31), HEADERS_JMEDIA_JMISC (D105.4 D105.7 JMISC.50)
MD_LPASS_GPIO_123: MODULE_MD (MODULE1.B33), HEADERS_JMEDIA_JMISC (D105.5 D105.6 JMISC.52)
MD_LPASS_GPIO_125: MODULE_MD (MODULE1.C29), HDMI_CONVERTER (U22.C2)
MD_LPASS_GPIO_126: MODULE_MD (MODULE1.B32), HDMI_CONVERTER (U22.D3)
MD_LPASS_GPIO_127: MODULE_MD (MODULE1.C30), HDMI_CONVERTER (U22.C1)
MD_LPASS_GPIO_129: MODULE_MD (MODULE1.A36), WIFI_BLE (R353.1)
MD_LPASS_GPIO_130: MODULE_MD (MODULE1.B35), WIFI_BLE (R343.1)
MD_LPASS_GPIO_131: MODULE_MD (MODULE1.B36), WIFI_BLE (R344.1 R347.1)
MD_LPASS_GPIO_132: MODULE_MD (MODULE1.A35), WIFI_BLE (R345.1 R348.1)
MD_PCIE0_2LANES.REFCLK_N: MODULE_MD (MODULE1.BC21), PCIE_PACKET_SWITCH (U34.AF34)
MD_PCIE0_2LANES.REFCLK_P: MODULE_MD (MODULE1.BC22), PCIE_PACKET_SWITCH (U34.AG35)
MD_PCIE0_2LANES.RX0_N: MODULE_MD (MODULE1.BE22), PCIE_PACKET_SWITCH (C327.2)
MD_PCIE0_2LANES.RX0_P: MODULE_MD (MODULE1.BE23), PCIE_PACKET_SWITCH (C326.2)
MD_PCIE0_2LANES.RX1_N: MODULE_MD (MODULE1.BF23), PCIE_PACKET_SWITCH (U34.A13)
MD_PCIE0_2LANES.RX1_P: MODULE_MD (MODULE1.BF24), PCIE_PACKET_SWITCH (U34.A11)
MD_PCIE0_2LANES.TX0_N: MODULE_MD (MODULE1.BE19), PCIE_PACKET_SWITCH (U34.B6)
MD_PCIE0_2LANES.TX0_P: MODULE_MD (MODULE1.BE20), PCIE_PACKET_SWITCH (U34.B4)
MD_PCIE0_2LANES.TX1_N: MODULE_MD (MODULE1.BF20), PCIE_PACKET_SWITCH (U34.A9)
MD_PCIE0_2LANES.TX1_P: MODULE_MD (MODULE1.BF21), PCIE_PACKET_SWITCH (U34.B10)
MD_PCIE1_4LANES.REFCLK_N: MODULE_MD (MODULE1.BC17), PCIE_NVME (D32.1 D32.10 J10.53)
MD_PCIE1_4LANES.REFCLK_P: MODULE_MD (MODULE1.BC18), PCIE_NVME (D32.2 D32.9 J10.55)
MD_PCIE1_4LANES.RX0_N: MODULE_MD (MODULE1.BF16), PCIE_NVME (D31.1 D31.10 J10.41)
MD_PCIE1_4LANES.RX0_P: MODULE_MD (MODULE1.BF17), PCIE_NVME (D31.2 D31.9 J10.43)
MD_PCIE1_4LANES.RX1_N: MODULE_MD (MODULE1.BE15), PCIE_NVME (D30.1 D30.10 J10.29)
MD_PCIE1_4LANES.RX1_P: MODULE_MD (MODULE1.BE16), PCIE_NVME (D30.2 D30.9 J10.31)
MD_PCIE1_4LANES.RX2_N: MODULE_MD (MODULE1.BD14), PCIE_NVME (D29.1 D29.10 J10.17)
MD_PCIE1_4LANES.RX2_P: MODULE_MD (MODULE1.BD15), PCIE_NVME (D29.2 D29.9 J10.19)
MD_PCIE1_4LANES.RX3_N: MODULE_MD (MODULE1.BC13), PCIE_NVME (D28.1 D28.10 J10.5)
MD_PCIE1_4LANES.RX3_P: MODULE_MD (MODULE1.BC14), PCIE_NVME (D28.2 D28.9 J10.7)
MD_PCIE1_4LANES.TX0_N: MODULE_MD (MODULE1.BF12), PCIE_NVME (D31.4 D31.7 J10.47)
MD_PCIE1_4LANES.TX0_P: MODULE_MD (MODULE1.BF13), PCIE_NVME (D31.5 D31.6 J10.49)
MD_PCIE1_4LANES.TX1_N: MODULE_MD (MODULE1.BE11), PCIE_NVME (D30.4 D30.7 J10.35)
MD_PCIE1_4LANES.TX1_P: MODULE_MD (MODULE1.BE12), PCIE_NVME (D30.5 D30.6 J10.37)
MD_PCIE1_4LANES.TX2_N: MODULE_MD (MODULE1.BD10), PCIE_NVME (D29.4 D29.7 J10.23)
MD_PCIE1_4LANES.TX2_P: MODULE_MD (MODULE1.BD11), PCIE_NVME (D29.5 D29.6 J10.25)
MD_PCIE1_4LANES.TX3_N: MODULE_MD (MODULE1.BC9), PCIE_NVME (D28.4 D28.7 J10.11)
MD_PCIE1_4LANES.TX3_P: MODULE_MD (MODULE1.BC10), PCIE_NVME (D28.5 D28.6 J10.13)
MD_QUP1_SE4_I2C_3V3.SCL: TOP (R155.2), POWER (U20.5), T8CH_ (U33_5.20), PCIE_PACKET_SWITCH (R311.2), PCIE_USB (R318.1)
MD_QUP1_SE4_I2C_3V3.SDA: TOP (R158.2), POWER (U20.6), T8CH_ (U33_5.18), PCIE_PACKET_SWITCH (R310.2), PCIE_USB (R189.1)
MD_SGMII0.RX_N: MODULE_MD (MODULE1.BF26), ETH_PHY (C112.2)
MD_SGMII0.RX_P: MODULE_MD (MODULE1.BE26), ETH_PHY (C247.2)
MD_SGMII0.TX_N: MODULE_MD (MODULE1.BC25), ETH_PHY (U1.42)
MD_SGMII0.TX_P: MODULE_MD (MODULE1.BC26), ETH_PHY (U1.40)
MD_USB0_3.1.HS_D_N: MODULE_MD (MODULE1.BD6), USB_USBC (D72.2 D72.9 J1.A7 J1.B7)
MD_USB0_3.1.HS_D_P: MODULE_MD (MODULE1.BD7), USB_USBC (D72.1 D72.10 J1.A6 J1.B6)
MD_USB0_3.1.SS_RX_N: MODULE_MD (MODULE1.BB1), USB_MUX (U6.17)
MD_USB0_3.1.SS_RX_P: MODULE_MD (MODULE1.BA1), USB_MUX (U6.16)
MD_USB0_3.1.SS_TX_N: MODULE_MD (MODULE1.BF6), USB_MUX (U6.12)
MD_USB0_3.1.SS_TX_P: MODULE_MD (MODULE1.BF5), USB_MUX (U6.11)
MD_USB1_2.0.HS_D_N: MODULE_MD (MODULE1.BF8), STM32 (R383.1)
MD_USB1_2.0.HS_D_P: MODULE_MD (MODULE1.BF9), STM32 (R382.1)
MIC_IN5_IN6.BIAS: AUDIO_CODEC (C110.2 U23.28), HEADERS_JOMEGA (D24.2 JOMEGA.61), HEADERS_JMEDIA_JMISC (D100.2 JMISC.33)
MIC_IN5_IN6.INN: AUDIO_CODEC (C254.2), HEADERS_JOMEGA (D21.2 JOMEGA.59)
MIC_IN5_IN6.INP: AUDIO_CODEC (C253.2), HEADERS_JOMEGA (D17.2 JOMEGA.57)
MUX_SSRX1_N: USB (C51.1), USB_MUX (U6.24)
MUX_SSRX1_P: USB (C50.1), USB_MUX (U6.25)
MUX_SSRX2_N: USB (C53.1), USB_MUX (U6.33)
MUX_SSRX2_P: USB (C52.1), USB_MUX (U6.34)
MUX_TX1_N: USB (R452.2), USB_MUX (U6.27)
MUX_TX1_P: USB (R451.2), USB_MUX (U6.28)
MUX_TX2_N: USB (R454.2), USB_MUX (U6.30)
MUX_TX2_P: USB (R453.2), USB_MUX (U6.31)
NetC12_2: ETH_PHY (5 pins), ETH_RJ45 (J2.1 J2.6 J2.7 J2.12)
NetC35_2: USB (C35.2 C37.2), USB_USBA (J7.10), U_USB/U_LOAD_SWITCH_5V (U27_1.7 U27_1.8 U27_1.9 U27_1.10)
NetC36_2: ETH_PHY (C36.2 R85.2), U_ETH/U_ETH_PHY/U_LOAD_SWITCH_5V (U27_3.1)
NetC76_1: POWER (R229.2 R273.2 TP60.X), POWER_DCDC_SOM (15 pins), POWER_REGULATORS_CARRIER (6 pins)
NetC107_2: HEADERS_UNO (JDIGITAL.16), STM32 (C107.2 C291.2 U3.K5), ANALOG_SWITCH (U28.3)
NetC119_2: POWER (R22.1 R150.1), POWER_REGULATORS_CARRIER (9 pins)
NetC147_2: USB (C147.2 C171.2), USB_USBA (J7.1), U_USB/U_LOAD_SWITCH_5V (U27_2.7 U27_2.8 U27_2.9 U27_2.10)
NetC209_2: AUDIO_CODEC (C209.2), HEADERS_JMEDIA_JMISC (D98.2 JMISC.29)
NetC217_2: AUDIO_CODEC (C217.2), HEADERS_JMEDIA_JMISC (D99.2 JMISC.31)
NetC224_2: PCIE_NVME (16 pins), U_PCIE/U_PCIE_NVME/U_LOAD_SWITCH_5V (U27_6.7 U27_6.8 U27_6.9 U27_6.10)
NetC248_2: AUDIO_CODEC (C248.2 U23.5), HEADERS_JMEDIA_JMISC (D104.1 D104.10 JMISC.36)
NetC295_2: AUDIO_CODEC (C295.2 U23.7), HEADERS_JMEDIA_JMISC (D104.2 D104.9 JMISC.38)
NetC342_1: POWER (D22.2 J8.5), CAN_PHY (C342.1 R506.2 U7.7)
NetC345_2: POWER (R496.1 R497.1), POWER_REGULATORS_CARRIER (C345.2 R130.1 U14.4)
NetC361_1: POWER (D23.2 J8.4), CAN_PHY (C361.1 R507.1 U7.6)
NetD16_1: HDMI_CONNECTOR (D16.1 D16.10 J4.13), HDMI_CONVERTER (U22.D6)
NetD16_2: HDMI_CONNECTOR (D16.2 D16.9 J4.15 R490.2), HDMI_CONVERTER (U22.D1)
NetD16_4: HDMI (R112.2), HDMI_CONNECTOR (D16.4 D16.7 J4.19), HDMI_CONVERTER (U22.C4)
NetD16_5: HDMI_CONNECTOR (D16.5 D16.6 J4.16 R491.2), HDMI_CONVERTER (U22.D2)
NetD61_2: TOP (R219.1), HEADERS_JCTL (D61.2 JCTL.3 TP58.X)
NetD62_2: TOP (R433.1), HEADERS_JCTL (D62.2 JCTL.5 TP59.X)
NetD103_1: AUDIO_CODEC (U23.13), HEADERS_JMEDIA_JMISC (D103.1 D103.10 JMISC.28)
NetD103_2: AUDIO_CODEC (U23.12), HEADERS_JMEDIA_JMISC (D103.2 D103.9 JMISC.30)
NetD103_4: AUDIO_CODEC (U23.10), HEADERS_JMEDIA_JMISC (D103.4 D103.7 JMISC.32)
NetD103_5: AUDIO_CODEC (R481.2), HEADERS_JMEDIA_JMISC (D103.5 D103.6 JMISC.34)
NetD104_4: AUDIO_CODEC (U23.6), HEADERS_JMEDIA_JMISC (D104.4 D104.7 JMISC.40)
NetD104_5: AUDIO_CODEC (U23.8), HEADERS_JMEDIA_JMISC (D104.5 D104.6 JMISC.42)
NetJ2_13: ETH (R111.1), ETH_RJ45 (J2.13)
NetJ2_17: ETH (R110.1), ETH_RJ45 (J2.17)
NetJOMEGA_54: HEADERS_JOMEGA (JOMEGA.54), PCIE_USB (U24.B33)
NetJOMEGA_56: HEADERS_JOMEGA (JOMEGA.56), PCIE_USB (U24.A36)
NetJOMEGA_58: HEADERS_JOMEGA (JOMEGA.58), PCIE_USB (U24.A46)
NetJOMEGA_60: HEADERS_JOMEGA (JOMEGA.60), PCIE_USB (U24.B43)
NetMODULE1_A6: TOP (R216.1 U25.4), MODULE_CONTROL (MODULE1.A6)
NetMODULE1_BA29: MODULE_SAIL (MODULE1.BA29), MODULE_SAIL_FLASH (R59.1 TP27.X U2.C2)
NetMODULE1_BB28: MODULE_SAIL (MODULE1.BB28), MODULE_SAIL_FLASH (TP54.X U2.D5)
NetMODULE1_BB29: MODULE_SAIL (MODULE1.BB29), MODULE_SAIL_FLASH (R58.1 TP52.X U2.C4)
NetMODULE1_BB43: TOP (R488.1), MODULE_SAIL (MODULE1.BB43)
NetMODULE1_BC28: MODULE_SAIL (MODULE1.BC28), MODULE_SAIL_FLASH (TP31.X U2.C3)
NetMODULE1_BC29: MODULE_SAIL (MODULE1.BC29), MODULE_SAIL_FLASH (TP28.X U2.B2)
NetMODULE1_BD28: MODULE_SAIL (MODULE1.BD28), MODULE_SAIL_FLASH (TP55.X U2.E3)
NetMODULE1_BD29: MODULE_SAIL (MODULE1.BD29), MODULE_SAIL_FLASH (R57.1 TP53.X U2.D4)
NetMODULE1_BD41: MODULE_SAIL (MODULE1.BD41), MODULE_SAIL_FLASH (R60.1 TP26.X U2.A4)
NetMODULE1_BE28: MODULE_SAIL (MODULE1.BE28), MODULE_SAIL_FLASH (TP56.X U2.E2)
NetMODULE1_BE29: MODULE_SAIL (MODULE1.BE29), MODULE_SAIL_FLASH (TP50.X U2.D3)
NetMODULE1_BE36: MODULE (TP93.X), MODULE_SAIL (MODULE1.BE36)
NetMODULE1_BF28: MODULE_SAIL (MODULE1.BF28), MODULE_SAIL_FLASH (TP51.X U2.D2)
NetMODULE1_BF29: MODULE_SAIL (MODULE1.BF29), MODULE_SAIL_FLASH (TP57.X U2.E1)
NetMODULE1_BF36: MODULE (TP32.X), MODULE_SAIL (MODULE1.BF36)
NetMODULE1_D28: TOP (R125.2), MODULE_CONTROL (MODULE1.D28)
NetPB1_3: TOP (R188.1 R477.1), PUSHBUTTONS (PB1.3 PB1.4)
NetQ3_2: USB_PD_CONTROLLER (R368.1), POWER (Q3.2 R249.1 TP82.X)
NetQ3_3: USB_PD_CONTROLLER (R367.1), POWER (Q3.3)
NetQ4_3: TOP (R174.2), HEADERS_JCTL (Q4.3 R166.2)
NetQ4_6: TOP (R346.2), HEADERS_JCTL (Q4.6 R458.2)
NetR23_1: WIFI_BLE (R23.1 U12.30), U_PCIE/U_WIFI_BLE/U_TRANSLATOR_4CH (U21_4.3)
NetR24_2: WIFI_BLE (R24.2), U_PCIE/U_WIFI_BLE/U_TRANSLATOR_4CH (U21_4.8)
NetR25_2: USB (R25.2), U_USB/U_LOAD_SWITCH_5V (U27_1.4)
NetR26_2: USB (R26.2), U_USB/U_LOAD_SWITCH_5V (U27_2.4)
NetR62_1: ETH (TP45.X), ETH_PHY (R62.1 R77.2 U1.26)
NetR63_1: ETH (TP44.X), ETH_PHY (R63.1 R78.2 U1.27)
NetR64_1: ETH (TP46.X), ETH_PHY (R64.1 R79.2 U1.45)
NetR65_1: ETH (TP47.X), ETH_PHY (R65.1 R80.2 U1.29)
NetR66_1: ETH (U9.2), ETH_PHY (R66.1 R81.2 U1.49)
NetR67_1: ETH (U8.2), ETH_PHY (R67.1 R82.2 U1.48)
NetR68_1: ETH (TP48.X), ETH_PHY (R68.1 R83.2 U1.46)
NetR97_1: USB_MUX (R97.1 R406.2), USB_PD_CONTROLLER (R102.1)
NetR98_1: USB_MUX (R98.1 R407.2), USB_PD_CONTROLLER (R103.1)
NetR112_1: HDMI (R112.1 R269.2), U_MIPI/U_MIPI_MUX (U10_1.17)
NetR140_2: MICROCONTROLLER (R140.2), U_MICROCONTROLLER/U_TRANSLATOR_4CH (U21_3.10)
NetR150_2: POWER (R150.2), POWER_REGULATORS_CARRIER (U16.1)
NetR151_2: MICROCONTROLLER (R151.2), U_MICROCONTROLLER/U_TRANSLATOR_4CH (U21_3.9)
NetR152_2: MICROCONTROLLER (R152.2), U_MICROCONTROLLER/U_TRANSLATOR_4CH (U21_3.8)
NetR153_2: MICROCONTROLLER (R153.2), U_MICROCONTROLLER/U_TRANSLATOR_4CH (U21_3.7)
NetR154_2: USB (R154.2), U_USB/U_LOAD_SWITCH_5V (U27_2.1), PCIE_USB (U24.A48)
NetR161_2: USB_PD_CONTROLLER (R161.2), U_USB/U_USB_PD_CONTROLLER/T8CH_ (U33_1.5)
NetR162_2: VIDEO (R162.2), U_MIPI/U_MIPI_MUX (U10_2.2)
NetR172_2: USB_PD_CONTROLLER (R172.2), U_USB/U_USB_PD_CONTROLLER/T8CH_ (U33_1.8)
NetR173_1: USB_PD_CONTROLLER (R173.1), U_USB/U_USB_PD_CONTROLLER/T8CH_ (U33_1.13)
NetR178_2: USB_PD_CONTROLLER (R178.2), U_USB/U_USB_PD_CONTROLLER/T8CH_ (U33_1.6)
NetR182_2: USB (R182.2), U_USB/U_LOAD_SWITCH_5V (U27_1.1), PCIE_USB (U24.B34)
NetR183_2: PCIE_NVME (R183.2), U_PCIE/U_PCIE_NVME/U_LOAD_SWITCH_5V (U27_6.4)
NetR186_2: USB_PD_CONTROLLER (R186.2), U_USB/U_USB_PD_CONTROLLER/T8CH_ (U33_1.1)
NetR187_2: USB_PD_CONTROLLER (R187.2), U_USB/U_USB_PD_CONTROLLER/T8CH_ (U33_1.7)
NetR215_1: USB_PD_CONTROLLER (U5.43), POWER (R215.1 U29.3)
NetR235_2: USB_PD_CONTROLLER (R235.2), U_USB/U_USB_PD_CONTROLLER/T8CH_ (U33_1.3)
NetR237_2: USB_PD_CONTROLLER (R237.2), U_USB/U_USB_PD_CONTROLLER/T8CH_ (U33_1.4)
NetR268_1: VIDEO (R268.1), U_MIPI/U_MIPI_MUX (U10_2.16)
NetR315_2: PCIE (R315.2), U_PCIE/U_TRANSLATOR_4CH (U21_5.5)
NetR323_2: PCIE (R323.2), U_PCIE/U_TRANSLATOR_4CH (U21_5.7)
NetR324_2: USB_PD_CONTROLLER (R324.2), U_USB/U_USB_PD_CONTROLLER/T8CH_ (U33_1.9)
NetR325_1: USB_PD_CONTROLLER (R325.1), U_USB/U_USB_PD_CONTROLLER/T8CH_ (U33_1.12)
NetR336_2: POWER (R336.2), U_POWER/U_LOAD_SWITCH_5V (U27_4.1)
NetR337_2: POWER (R337.2), U_POWER/U_LOAD_SWITCH_5V (U27_5.1)
NetR339_2: POWER (R339.2), U_POWER/U_LOAD_SWITCH_5V (U27_4.4)
NetR341_2: POWER (R341.2), U_POWER/U_LOAD_SWITCH_5V (U27_5.4)
NetR342_2: ETH_PHY (R342.2), U_ETH/U_ETH_PHY/U_LOAD_SWITCH_5V (U27_3.4)
NetR349_2: TOP (R349.2), MODULE_CONTROL (R402.2 U36.2)
NetR350_2: TOP (R350.2), MODULE_CONTROL (R489.2 U4.6 U19.2)
NetR361_1: MICROCONTROLLER (R361.1), U_MICROCONTROLLER/U_TRANSLATOR_4CH (U21_3.2)
NetR362_1: MICROCONTROLLER (R362.1), U_MICROCONTROLLER/U_TRANSLATOR_4CH (U21_3.3)
NetR363_1: MICROCONTROLLER (R363.1), U_MICROCONTROLLER/U_TRANSLATOR_4CH (U21_3.4)
NetR364_1: MICROCONTROLLER (R364.1), U_MICROCONTROLLER/U_TRANSLATOR_4CH (U21_3.5)
NetR386_2: VIDEO (R386.2), U_MIPI/U_MIPI_MUX (U10_3.2)
NetR392_1: VIDEO (R392.1), U_MIPI/U_MIPI_MUX (U10_3.16)
NetR393_1: VIDEO (R393.1), U_MIPI/U_MIPI_MUX (U10_1.2)
NetR394_1: VIDEO (R394.1), U_MIPI/U_MIPI_MUX (U10_1.16)
NetR395_1: VIDEO (R395.1), U_MIPI/U_TRANSLATOR_4CH (U21_2.7)
NetR396_2: VIDEO (R396.2), U_MIPI/U_TRANSLATOR_4CH (U21_2.5)
NetR428_2: WIFI_BLE (R428.2), U_PCIE/U_WIFI_BLE/U_TRANSLATOR_4CH (U21_4.7)
NetR429_2: WIFI_BLE (R429.2), U_PCIE/U_WIFI_BLE/U_TRANSLATOR_4CH (U21_4.5)
NetR461_2: WIFI_BLE (R461.2), U_PCIE/U_WIFI_BLE/U_TRANSLATOR_4CH (U21_4.4)
NetR463_2: PCIE_PACKET_SWITCH (U34.AN35), WIFI_BLE (R463.2), U_PCIE/U_WIFI_BLE/U_TRANSLATOR_4CH (U21_4.9)
NetR464_2: PCIE_PACKET_SWITCH (U34.G1), WIFI_BLE (R464.2 R467.2), U_PCIE/U_WIFI_BLE/U_TRANSLATOR_4CH (U21_4.10)
NetR465_1: WIFI_BLE (R465.1 R466.2 U12.31), U_PCIE/U_WIFI_BLE/U_TRANSLATOR_4CH (U21_4.2)
NetTP2_X: USB (TP2.X), USB_MUX (U6.22)
NetTP3_X: USB (TP3.X), USB_MUX (U6.19)
NetTP4_X: USB (TP4.X), USB_MUX (U6.21)
NetTP5_X: USB (TP5.X), USB_MUX (U6.20)
NetTP40_X: TOP (TP40.X), ETH_PHY (U1.44)
NetTP41_X: TOP (TP41.X), ETH_PHY (U1.30)
NetTP42_X: TOP (TP42.X), ETH_PHY (U1.24)
NetTP43_X: ETH (TP43.X), ETH_PHY (U1.25)
NetTP49_X: ETH (TP49.X), ETH_PHY (U1.31)
NetU24_A40: PCIE_PACKET_SWITCH (U34.K2), PCIE_USB (U24.A40)
NetU24_B36: PCIE_PACKET_SWITCH (U34.AK34), PCIE_USB (U24.B36)
NRST: HEADERS_UNO (JANALOG.3 JSPI.5), MICROCONTROLLER (R140.1), STM32 (C270.2 R181.1 R384.1 TP35.X)
~{PM_RESIN_N_3V3}: TOP (R216.2 R487.1 U25.2), HEADERS_JOMEGA (D26.1 D26.10 JOMEGA.78), HEADERS_JCTL (D67.2 JCTL.8)
~{POWER_DISABLE_7-24V}: TOP (Q7.3), POWER_DCDC_SOM (5 pins), HEADERS_JOMEGA (JOMEGA.87), HEADERS_JCTL (R486.1)
~{PWR_EN_N_3V3}: TOP (R188.2 R219.2 R350.1), HEADERS_JOMEGA (D25.4 D25.7 JOMEGA.74)
PA0: STM32 (U3.L2), HEADERS_JMEDIA_JMISC (JMISC.20)
PA1: STM32 (U3.L4), HEADERS_JMEDIA_JMISC (JMISC.22)
PA2: STM32 (U3.M3), HEADERS_JMEDIA_JMISC (JMISC.24)
PA4: HEADERS_UNO (JANALOG.9), STM32 (U3.N3)
PA5: HEADERS_UNO (JANALOG.10), STM32 (U3.P2)
PA6: STM32 (U3.R2), HEADERS_JMEDIA_JMISC (JMISC.17)
PA7: STM32 (U3.P3), HEATSINK_FAN (R261.1 R262.2)
PA8: STM32 (R376.1 U3.G11), QWIIC (D80.2 J13.4 TP72.X)
PA9: STM32 (U3.G13), HEADERS_JMEDIA_JMISC (JMISC.1)
PA10: HEADERS_JOMEGA (JOMEGA.92), STM32 (U3.F13)
PA11: STM32 (U3.F15), HEADERS_JMEDIA_JMISC (JMISC.23)
PA12: STM32 (U3.F14), HEADERS_JMEDIA_JMISC (JMISC.25)
PA13: MICROCONTROLLER (R152.1), STM32 (TP67.X U3.F12)
PA14: MICROCONTROLLER (R153.1), STM32 (TP68.X U3.C15)
PA_VBUS: USB_USBC (7 pins), USB_PD_CONTROLLER (D4.A U5.41 U5.42), POWER (C294.2 Q5.D R213.2 U29.1)
PB0: HEADERS_UNO (JDIGITAL.3), STM32 (U3.R3)
PB1: HEADERS_UNO (JDIGITAL.4), STM32 (U3.L6)
PB2: HEADERS_UNO (JDIGITAL.7), STM32 (U3.P4)
PB3: HEADERS_UNO (JDIGITAL.8), STM32 (TP70.X U3.B7)
PB4: HEADERS_UNO (JDIGITAL.9), STM32 (U3.C7)
PB5: HEADERS_UNO (JDIGITAL.6), STM32 (U3.E7)
PB6: HEADERS_UNO (JDIGITAL.5), STM32 (U3.E8)
PB7: HEADERS_UNO (JDIGITAL.10), STM32 (U3.A6)
PB10: HEADERS_UNO (JDIGITAL.2), STM32 (U3.M10)
PB11: HEADERS_UNO (JDIGITAL.1), STM32 (U3.P11)
PB12: HEADERS_UNO (JDIGITAL.11), STM32 (U3.P14)
PB13: HEADERS_UNO (JDIGITAL.14), STM32 (U3.N13)
PB14: HEADERS_UNO (JDIGITAL.13), STM32 (U3.K11)
PB15: HEADERS_UNO (JDIGITAL.12), STM32 (U3.M13)
PC0: HEADERS_JOMEGA (JOMEGA.39), STM32 (U3.L1)
PC1: HEADERS_JOMEGA (JOMEGA.41), STM32 (U3.K2)
PC2: HEADERS_JOMEGA (JOMEGA.43), STM32 (U3.M1)
PC3: HEADERS_JOMEGA (JOMEGA.45), STM32 (U3.M2)
PC6: STM32 (U3.J15), U_MICROCONTROLLER/U_LED/U_LED_RGB (R207_4.1)
PC7: STM32 (U3.H14), HEADERS_JMEDIA_JMISC (JMISC.3)
PC8: STM32 (U3.H13), HEADERS_JMEDIA_JMISC (JMISC.5)
PC9: STM32 (R375.1 U3.G14), QWIIC (D81.2 J13.3 TP73.X)
PC10: HEADERS_UNO (JSPI.3), STM32 (U3.D12)
PC11: STM32 (U3.B14), HEADERS_JMEDIA_JMISC (JMISC.9)
PC12: HEADERS_UNO (JSPI.4), STM32 (U3.B15)
PCIE1_REFCLK0_N: PCIE_PACKET_SWITCH (U34.W35), WIFI_BLE (U12.33)
PCIE1_REFCLK0_P: PCIE_PACKET_SWITCH (U34.U35), WIFI_BLE (U12.34)
PCIE1_RX0_N: PCIE_PACKET_SWITCH (U34.B30), WIFI_BLE (U12.36)
PCIE1_RX0_P: PCIE_PACKET_SWITCH (U34.B32), WIFI_BLE (U12.37)
PCIE1_TX0_CAP_N: PCIE_PACKET_SWITCH (C307.1), WIFI_BLE (U12.39)
PCIE1_TX0_CAP_P: PCIE_PACKET_SWITCH (C299.1), WIFI_BLE (U12.40)
PCIE2_REFCLK0_N: PCIE_PACKET_SWITCH (U34.AC35), PCIE_USB (U24.B41)
PCIE2_REFCLK0_P: PCIE_PACKET_SWITCH (U34.AA35), PCIE_USB (U24.A45)
PCIE2_RX0_N: PCIE_PACKET_SWITCH (U34.A27), PCIE_USB (C325.1)
PCIE2_RX0_P: PCIE_PACKET_SWITCH (U34.B26), PCIE_USB (C324.1)
PCIE2_TX0_CAP_N: PCIE_PACKET_SWITCH (C323.1), PCIE_USB (U24.A42)
PCIE2_TX0_CAP_P: PCIE_PACKET_SWITCH (C322.1), PCIE_USB (U24.B39)
PD0: STM32 (U3.E10), CAN_PHY (U7.4)
PD1: STM32 (U3.C12), CAN_PHY (U7.1)
PD3: STM32 (U3.A14), HEADERS_JMEDIA_JMISC (JMISC.11)
PD5: HEADERS_JOMEGA (JOMEGA.86), STM32 (U3.B12)
PD9: HEADERS_JOMEGA (JOMEGA.94), STM32 (U3.P15)
PD10: STM32 (U3.N14), U_MICROCONTROLLER/U_LED/U_LED_RGB (R208_2.2)
PD11: STM32 (U3.N15), U_MICROCONTROLLER/U_LED/U_LED_RGB (R205_3.2)
PD12: HEADERS_JOMEGA (JOMEGA.47), STM32 (U3.M14)
PD13: HEADERS_JOMEGA (JOMEGA.49), STM32 (U3.L13)
PD14: HEADERS_JOMEGA (JOMEGA.51), STM32 (U3.J11)
PD15: HEADERS_JOMEGA (JOMEGA.53), STM32 (U3.K12)
PE1: STM32 (U3.B5), HEADERS_JMEDIA_JMISC (JMISC.7)
PE2: STM32 (U3.B3), HEADERS_JMEDIA_JMISC (JMISC.2)
PE3: STM32 (U3.D5), HEADERS_JMEDIA_JMISC (JMISC.4)
PE4: STM32 (U3.C4), HEADERS_JMEDIA_JMISC (JMISC.6)
PE5: STM32 (U3.D4), HEADERS_JMEDIA_JMISC (JMISC.8)
PE6: STM32 (U3.F6), HEADERS_JMEDIA_JMISC (JMISC.10)
PE7: STM32 (U3.L8), HEADERS_JMEDIA_JMISC (JMISC.12)
PE8: STM32 (U3.M8), HEADERS_JMEDIA_JMISC (JMISC.14)
PE12: HEADERS_UNO (JANALOG.11), STM32 (U3.L9)
PE13: HEADERS_UNO (JANALOG.12), STM32 (U3.P10)
PE14: HEADERS_UNO (JANALOG.13), STM32 (U3.N10)
PE15: HEADERS_UNO (JANALOG.14), STM32 (U3.R11)
PF0: STM32 (R373.1 U3.E1), HEADERS_JMEDIA_JMISC (JMISC.18)
PF1: STM32 (R374.1 U3.G4), HEADERS_JMEDIA_JMISC (JMISC.16)
PF4: STM32 (U3.G1), HEADERS_JMEDIA_JMISC (JMISC.13)
PF6: HEADERS_JOMEGA (JOMEGA.98), STM32 (U3.H3)
PF7: HEADERS_JOMEGA (JOMEGA.100), STM32 (U3.H2)
PF14: HEADERS_UNO (JSPI.1), STM32 (U3.M7)
PG2: STM32 (U3.L15), U_MICROCONTROLLER/U_LED/U_LED_RGB (R205_4.2)
PG3: STM32 (U3.J12), U_MICROCONTROLLER/U_LED/U_LED_RGB (R205_1.2)
PG4: STM32 (U3.K14), U_MICROCONTROLLER/U_LED/U_LED_RGB (R205_2.2)
PG5: STM32 (U3.K15), U_MICROCONTROLLER/U_LED/U_LED_RGB (R208_3.2)
PG6: STM32 (U3.J13), U_MICROCONTROLLER/U_LED/U_LED_RGB (R208_1.2)
PG8: STM32 (U3.J14), U_MICROCONTROLLER/U_LED/U_LED_RGB (R208_4.2)
PG9: MICROCONTROLLER (R365.1), STM32 (U3.B9)
PG10: MICROCONTROLLER (R366.1), STM32 (U3.A9)
PG11: MICROCONTROLLER (R408.1), STM32 (U3.D8)
PG12: MICROCONTROLLER (R409.1), STM32 (U3.C8)
PG13: MICROCONTROLLER (R410.1), STM32 (U3.B8)
PG14: MICROCONTROLLER (R411.1), STM32 (U3.A8)
PG15: STM32 (U3.A7), HEATSINK_FAN (R264.2)
PH2: STM32 (U3.N1), LED_MATRIX (R108.2)
PH3: STM32 (U3.N2), LED_MATRIX (R195.2)
PH4: STM32 (U3.P1), LED_MATRIX (R196.2)
PH5: STM32 (U3.K6), LED_MATRIX (R197.2)
PH6: STM32 (U3.N11), LED_MATRIX (R198.2)
PH7: STM32 (U3.M11), LED_MATRIX (R199.2)
PH8: STM32 (U3.N12), HEADERS_JMEDIA_JMISC (JMISC.21)
PH9: STM32 (U3.P13), LED_MATRIX (R200.2)
PH10: STM32 (U3.K10), LED_MATRIX (R201.2)
PH11: HEADERS_UNO (JDIGITAL.18), STM32 (R372.1 U3.M12)
PH12: HEADERS_UNO (JDIGITAL.17), STM32 (R371.1 U3.R14)
PH13: STM32 (U3.E15), LED_MATRIX (R202.2)
PH14: STM32 (U3.E14), LED_MATRIX (R203.2)
PH15: STM32 (U3.E13), LED_MATRIX (R204.2)
PI2: HEADERS_JOMEGA (JOMEGA.55), STM32 (U3.F10)
PI5: STM32 (U3.A4), HEADERS_JMEDIA_JMISC (JMISC.19)
PI7: STM32 (U3.B4), HEADERS_JMEDIA_JMISC (JMISC.15)
PI8: MICROCONTROLLER (R184.2), STM32 (U3.E4), ANALOG_SWITCH (U28.6)
PI9: HEADERS_JOMEGA (JOMEGA.88), STM32 (U3.E2)
PI11: STM32 (U3.F3), CAN_PHY (U7.8)
PK0: STM32 (U3.M15), U_MICROCONTROLLER/U_LED/U_LED_RGB (R207_3.1)
PK1: STM32 (U3.L14), U_MICROCONTROLLER/U_LED/U_LED_RGB (R207_2.1)
PK2: STM32 (U3.K13), U_MICROCONTROLLER/U_LED/U_LED_RGB (R207_1.1)
PK10: TOP (R484.2), STM32 (U3.B2)
PK11: TOP (D44.A R510.1 R511.2), STM32 (U3.C2)
PK13: TOP (R482.2), STM32 (U3.B1)
PM_PS_HOLD: MODULE_CONTROL (MODULE1.C33), HEADERS_JOMEGA (D25.1 D25.10 JOMEGA.70)
RST_N_3V3: PCIE (R329.2), PCIE_PACKET_SWITCH (R143.2), U_PCIE/U_TRANSLATOR_4CH (U21_5.8)
RTSS_IO_4: MODULE_SAIL (MODULE1.BE39), MODULE_STRAPS_SAIL (R43.2 R56.2)
RTSS_IO_6: MODULE_SAIL (MODULE1.BF37), MODULE_STRAPS_SAIL (R40.2 R53.2)
RTSS_IO_7: MODULE_SAIL (MODULE1.BE37), MODULE_STRAPS_SAIL (R41.2 R54.2)
RTSS_IO_10: MODULE_SAIL (MODULE1.BC36), MODULE_STRAPS_SAIL (R32.2 R45.2)
RTSS_IO_11: MODULE_SAIL (MODULE1.BC37), MODULE_STRAPS_SAIL (R33.2 R46.2)
RTSS_IO_12: MODULE_SAIL (MODULE1.BD36), MODULE_STRAPS_SAIL (R34.2 R47.2)
RTSS_IO_14: MODULE_SAIL (MODULE1.BD39), MODULE_STRAPS_SAIL (R35.2 R48.2)
RTSS_IO_15: MODULE_SAIL (MODULE1.BC38), MODULE_STRAPS_SAIL (R36.2 R49.2)
RTSS_IO_16: MODULE_SAIL (MODULE1.BB38), MODULE_STRAPS_SAIL (R38.2 R51.2)
RTSS_IO_17: MODULE_SAIL (MODULE1.BC39), MODULE_STRAPS_SAIL (R39.2 R52.2)
RTSS_IO_18: MODULE_SAIL (MODULE1.AY35), MODULE_STRAPS_SAIL (R37.2 R50.2)
RTSS_IO_21: MODULE_SAIL (MODULE1.BA34), MODULE_STRAPS_SAIL (R42.2 R55.2)
RTSS_IO_51: MODULE_SAIL (MODULE1.AU46), MODULE_STRAPS_SAIL (R31.2 R44.2)
RTSS_IO_58_FORCE_USB_BOOT_SPX3_1P8: TOP (R346.1), MODULE_SAIL (MODULE1.BF40)
RTSS_PS_HOLD_SPX3_1P8: TOP (R488.2), HEADERS_JOMEGA (D26.4 D26.7 JOMEGA.82)
RTSS_RESIN_N: MODULE_SAIL (MODULE1.AY43), HEADERS_JOMEGA (D26.2 D26.9 JOMEGA.80)
SAIL_JTAG.SRST_N: MODULE_SAIL (MODULE1.AW37 TP65.X), HEADERS_JOMEGA (D39.1 D39.10 JOMEGA.71)
SAIL_JTAG.TCK: MODULE_SAIL (MODULE1.AW36 TP64.X), HEADERS_JOMEGA (D38.5 D38.6 JOMEGA.69)
SAIL_JTAG.TDI: MODULE_SAIL (MODULE1.BA37 TP63.X), HEADERS_JOMEGA (D38.4 D38.7 JOMEGA.67)
SAIL_JTAG.TDO: MODULE_SAIL (MODULE1.BA36 TP62.X), HEADERS_JOMEGA (D38.2 D38.9 JOMEGA.65)
SAIL_JTAG.TMS: MODULE_SAIL (MODULE1.AY36 TP61.X), HEADERS_JOMEGA (D38.1 D38.10 JOMEGA.63)
SAIL_JTAG.TRST_N: MODULE_SAIL (MODULE1.AY37 TP66.X), HEADERS_JOMEGA (D39.2 D39.9 JOMEGA.73)
SLEEP_CLK: MODULE_CONTROL (MODULE1.U41), WIFI_BLE (R440.1)
USB1_CAP_SSTX_N: HEADERS_JOMEGA (D18.2 D18.9 JOMEGA.20), PCIE_USB (C280.2)